# EasyEDA schematic SCH_PCB project A_2022-12-09.json
TITLE: Linefollower Elektrischschema A; REV: 1.0; Date: 2022-12-10; Sheet: 1/1; Drawn By: Robbe Vaillemans; Company: Hogent
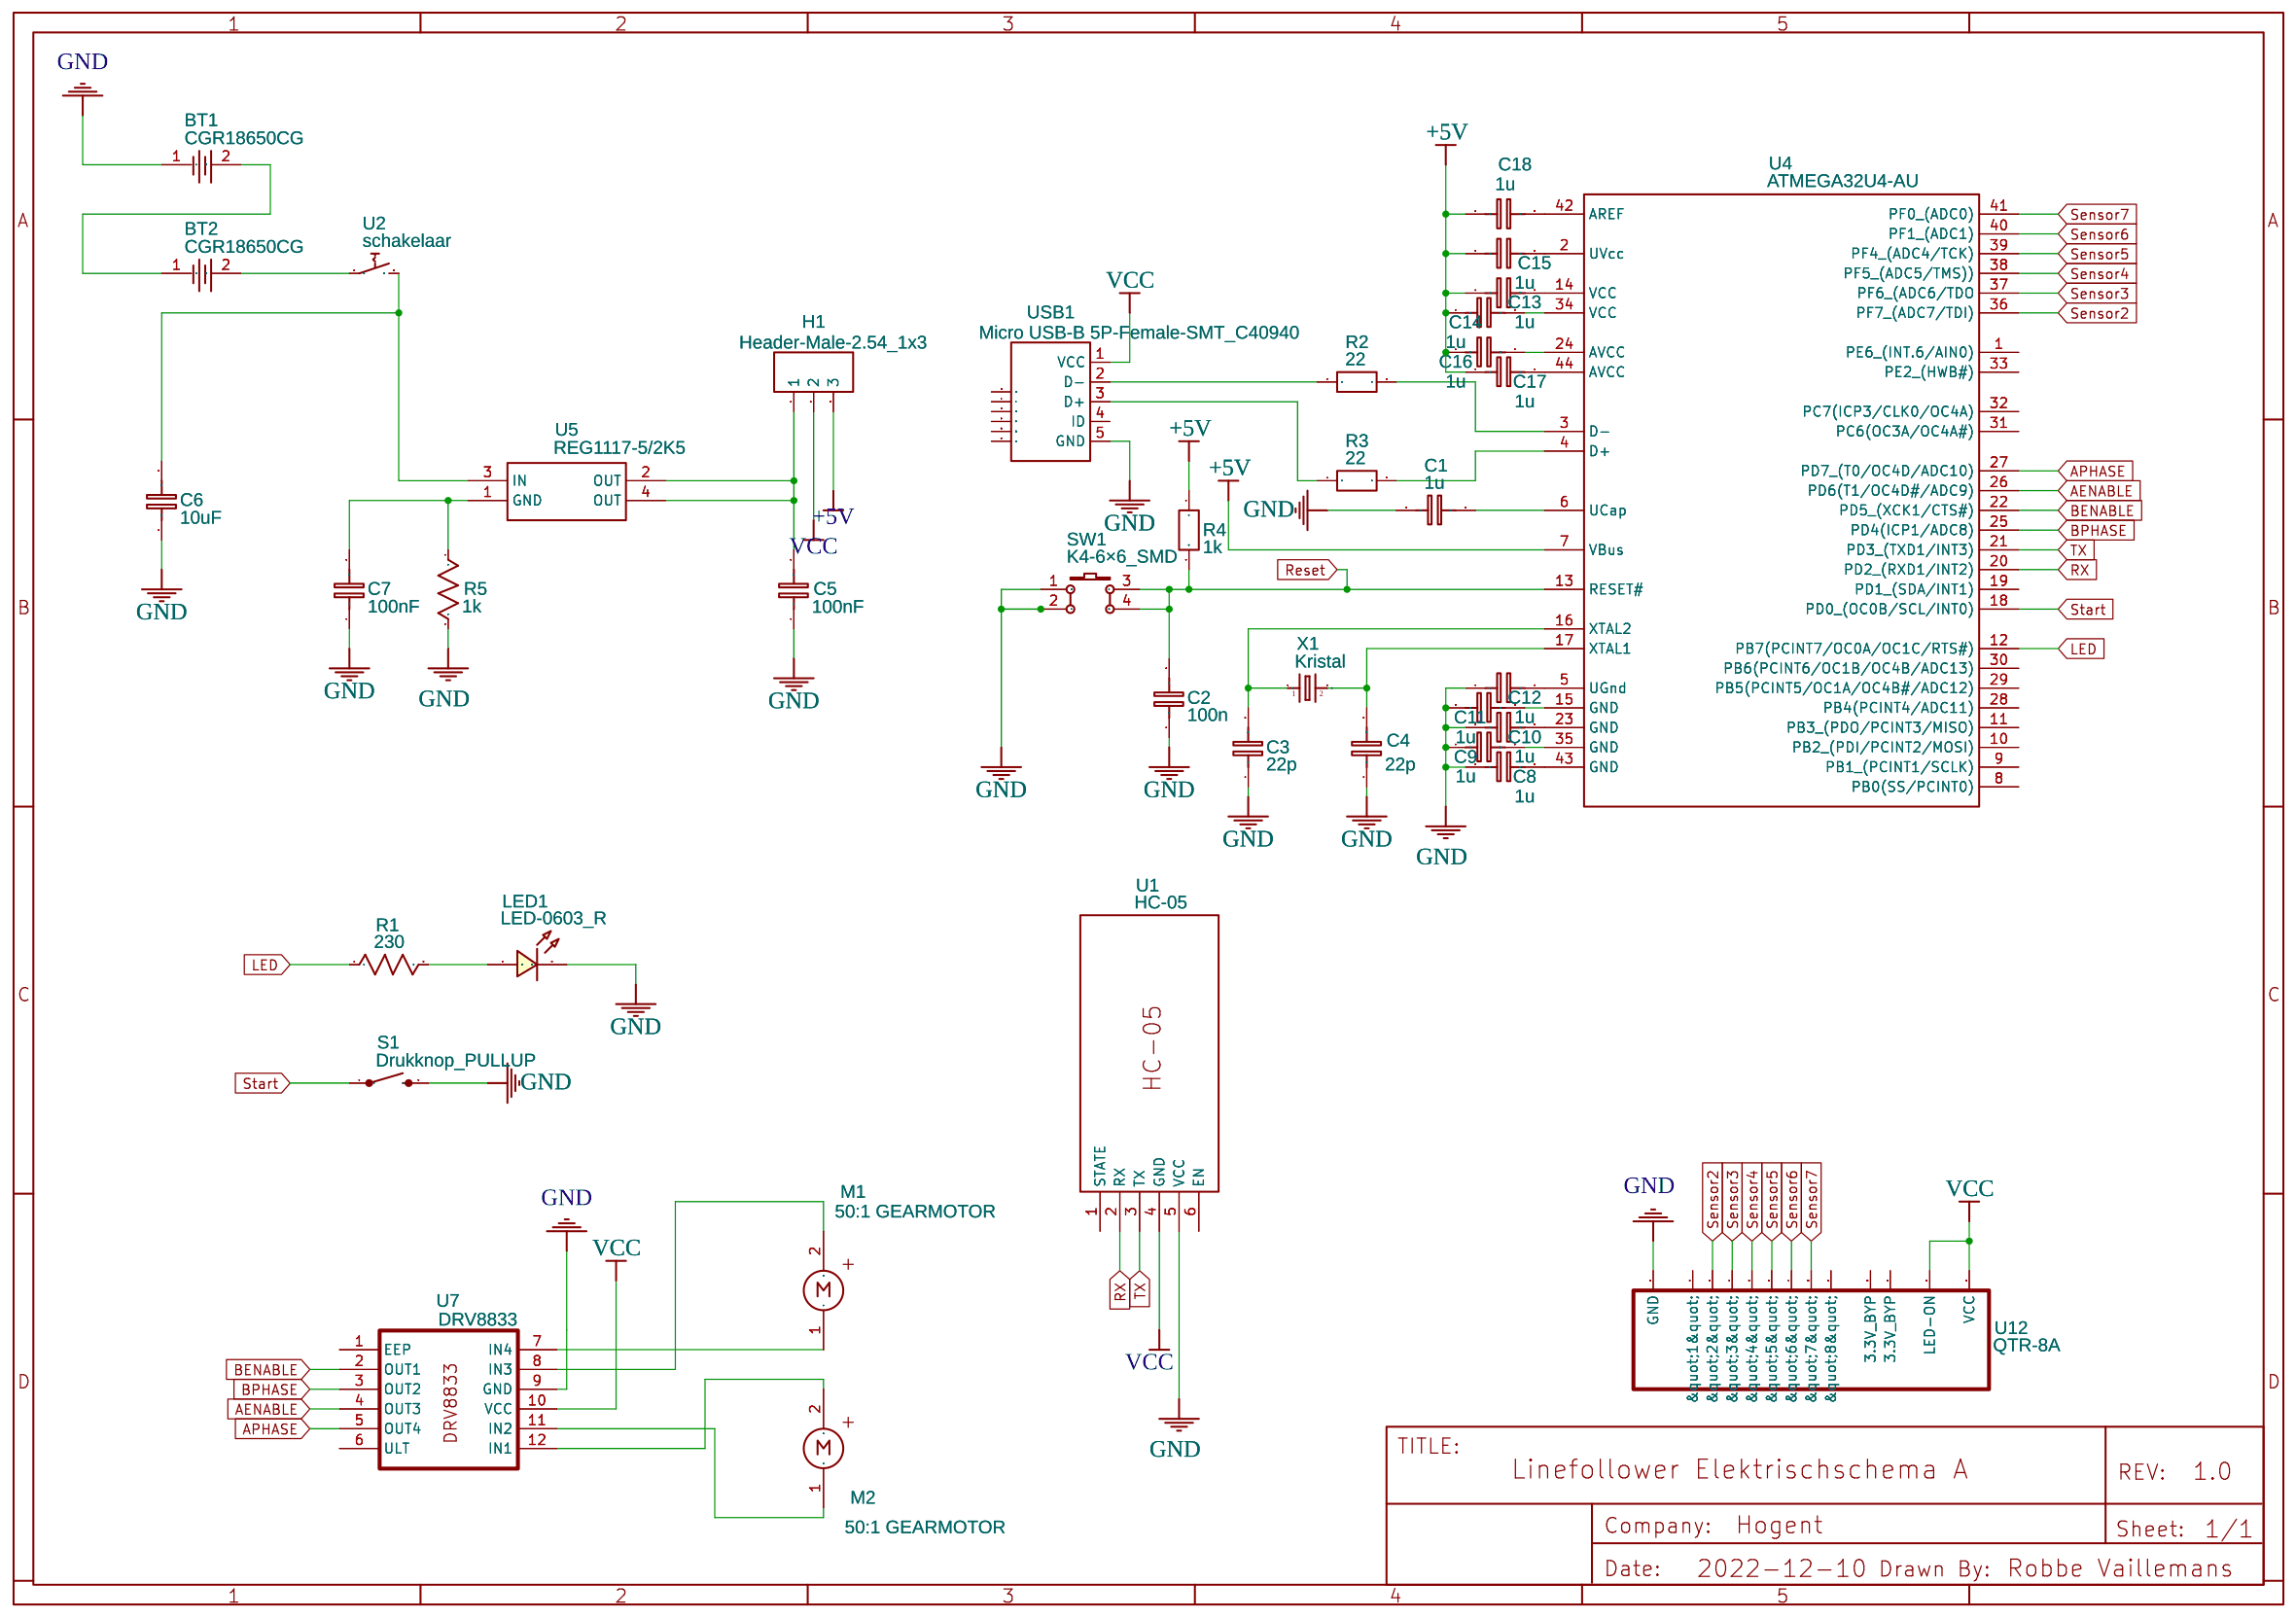
[diagram p0: schematic sheet]

## Parts
BT1  CGR18650CG  [BATTERY-SMD_18650-1S-L77.1-W20.7-1]
BT2  CGR18650CG  [BATTERY-SMD_18650-1S-L77.1-W20.7-1]
C1  1u  [C0603]
C2  100n  [C0603]
C3  22p  [C0603]
C4  22p  [C0603]
C5  100nF  [C0603]
C6  10uF  [C0603]
C7  100nF  [C0603]
C8  1u  [C0603]
C9  1u  [C0603]
C10  1u  [C0603]
C11  1u  [C0603]
C12  1u  [C0603]
C13  1u  [C0603]
C14  1u  [C0603]
C15  1u  [C0603]
C16  1u  [C0603]
C17  1u  [C0603]
C18  1u  [C0603]
H1  Header-Male-2.54_1x3  [HDR-TH_3P-P2.54-V-M-1]
LED1  LED-0603_R  [LED0603_RED]
M1  50:1 GEARMOTOR  [POLOLU-3071]
M2  50:1 GEARMOTOR  [POLOLU-3071]
R1  230  [R0603]
R2  22  [R0603]
R3  22  [R0603]
R4  1k  [R0603]
R5  1k  [R0603]
S1  Drukknop_PULLUP  [DRUKKNOP-PCB]
SW1  K4-6×6_SMD  [KEY-SMD_4P-L6.0-W6.0-P3.90-LS10.0]
U1  HC-05  [HM-10 LATEST]
U2  schakelaar
U4  ATMEGA32U4-AU  [QFP-44_L10.0-W10.0-P0.80-LS13.2-BL]
U5  REG1117-5/2K5  [SOT-223-4_L6.5-W3.5-P2.30-LS7.0-BR]
U7  DRV8833  [DRV8833 (NO ORIGINAL)]
U12  QTR-8A  [QTR-8A/8RC]
USB1  Micro USB-B 5P-Female-SMT_C40940  [MICRO-USB-SMD_5P-P0.65-H-M_MICRO-5P]
X1  Kristal  [KRISTAL]

## Library data of the parts
BT1 BT2 = BH-18650-B1BA002: Supplier: LCSC; Supplier Part: C2988620; Manufacturer: MYOUNG(美阳); link: https://atta.szlcsc.com/upload/public/pdf/source/20220402/870DB99AB50CA0DF8D51CF7C86A51FAB.pdf; Contributor: lcsc; JLCPCB Part Class: Extended Part
C1-C18 = C_0603_EU: Contributor: LCEDA_Lib
H1 = Header-Male-2.54_1x3: Supplier: LCSC; Manufacturer: BOOMELE; Manufacturer Part: Header2.54mm 1*3P; Supplier Part: C49257; JLCPCB Part Class: Extended Part
LED1 = LED-0603_R: Manufacturer: EVERLIGHT(台湾亿光); Manufacturer Part: 19-217/R6C-AL1M2VY/3T; Supplier Part: C72044; Supplier: LCSC; Contributor: LCEDA_01
M1 M2 = 10:1 MICRO METAL GEARMOTOR eskere: Manufacturer: Pololu; Manufacturer Part: 10:1 Micro Metal Gearmotor HPCB 6V with Extended Motor Shaft; Supplier: Pololu; Supplier Part: 3071; link: https://www.pololu.com/product/3071; Contributor: cheght
R1 R5 = R_0603_US: Contributor: LCEDA_Lib
R2-R4 = R_0603_EU: Contributor: LCEDA_Lib
S1 = Drukknop: Various NO switches- pushbuttons, reed, etc; Contributor: Dompie
SW1 = K4-6×6_SMD: Supplier Part: C191626; Supplier: LCSC; Manufacturer: 韩国韩荣; Manufacturer Part: K2-6639SP-D4SC-04; Contributor: LCEDA_Lib
U1 = HM-10: Contributor: jmprice50
U2 = schakelaar: Contributor: onschacline
U4 = ATMEGA32U4-AU: Supplier: LCSC; Manufacturer: MICROCHIP; Supplier Part: C44854; JLCPCB Part Class: Extended Part
U5 = REG1117-5/2K5: Supplier: LCSC; Manufacturer: TI; Contributor: LCSC; Supplier Part: C139393; JLCPCB Part Class: Extended Part
U7 = DRV8833 (NO ORIGINAL): Contributor: PiterSantaCruz
U12 = QTR-8A: Manufacturer: Pololu; Supplier: Pololu; Supplier Part: 960; link: https://www.pololu.com/docs/pdf/0J12/QTR-8x.pdf; Contributor: Junikos
USB1 = Micro USB-B 5P-Female-SMT_C40940: Supplier: LCSC; Manufacturer: ValuePro; Manufacturer Part: Micro USB-B 5P-Female-SMT; Contributor: LCSC; Supplier Part: C40940
X1 = Kristal: Contributor: Dompie

## Nets
+5V: C13.1 C14.1 C15.1 C16.1 C17.1 C18.1 H1.3 R4.1 U4.7(VBus)
GND: BT1.1 C1.1 C2.1 C3.1 C4.1 C5.1 C6.1 C7.1 C8.1 C9.1 C10.1 C11.1 C12.1 LED1.2 R5.2 S1.2 SW1.1(2) SW1.2(1) U1.5(VCC) U7.9(GND) U12.1(GND) USB1.5(GND)
VCC: H1.2 U1.4(GND) U7.10(VCC) U12.12(LED-ON) USB1.1(VCC)
AENABLE: U4.26(PD6(T1/OC4D#/ADC9)) U7.4(OUT3)
APHASE: U4.27(PD7 (T0/OC4D/ADC10)) U7.5(OUT4)
BENABLE: U4.22(PD5 (XCK1/CTS#)) U7.2(OUT1)
BPHASE: U4.25(PD4(ICP1/ADC8)) U7.3(OUT2)
LED: R1.1 U4.12(PB7(PCINT7/OC0A/OC1C/RTS#))
Reset: C2.2 R4.2 SW1.3(4) SW1.4(3) U4.13(RESET#)
RX: U1.2(RX) U4.20(PD2 (RXD1/INT2))
Sensor2: U4.36(PF7 (ADC7/TDI)) U12.3("2")
Sensor3: U4.37(PF6 (ADC6/TDO) U12.4("3")
Sensor4: U4.38(PF5 (ADC5/TMS))) U12.5("4")
Sensor5: U4.39(PF4 (ADC4/TCK)) U12.6("5")
Sensor6: U4.40(PF1 (ADC1)) U12.7("6")
Sensor7: U4.41(PF0 (ADC0)) U12.8("7")
Start: S1.1 U4.18(PD0 (OC0B/SCL/INT0))
TX: U1.3(TX) U4.21(PD3 (TXD1/INT3))
Net-(BT1-2): BT1.2 BT2.1
Net-(BT2-2): BT2.2 U2.2
Net-(C1-2): C1.2 U4.6(UCap)
Net-(C3-2): C3.2 U4.16(XTAL2) X1.1
Net-(C4-2): C4.2 U4.17(XTAL1) X1.2
Net-(C5-2): C5.2 H1.1 U5.2(OUT) U5.4(OUT)
Net-(C6-2): C6.2 U2.1 U5.3(IN)
Net-(C7-2): C7.2 R5.1 U5.1(GND)
Net-(C8-2): C8.2 U4.43(GND)
Net-(C9-2): C9.2 U4.35(GND)
Net-(C10-2): C10.2 U4.23(GND)
Net-(C11-2): C11.2 U4.15(GND)
Net-(C12-2): C12.2 U4.5(UGnd)
Net-(C13-2): C13.2 U4.14(VCC)
Net-(C14-2): C14.2 U4.34(VCC)
Net-(C15-2): C15.2 U4.2(UVcc)
Net-(C16-2): C16.2 U4.24(AVCC)
Net-(C17-2): C17.2 U4.44(AVCC)
Net-(C18-2): C18.2 U4.42(AREF)
Net-(LED1-1): LED1.1 R1.2
Net-(M1-1): M1.1 U7.7(IN4)
Net-(M1-2): M1.2 U7.8(IN3)
Net-(M2-1): M2.1 U7.11(IN2)
Net-(M2-2): M2.2 U7.12(IN1)
Net-(R2-1): R2.1 USB1.2(D-)
Net-(R2-2): R2.2 U4.3(D-)
Net-(R3-1): R3.1 USB1.3(D+)
Net-(R3-2): R3.2 U4.4(D+)

Not connected (* = marked no-connect by the designer): U1 1(STATE) 6(EN); U4 1(PE6 (INT.6/AIN0)) 8(PB0(SS/PCINT0)) 9(PB1 (PCINT1/SCLK)) 10(PB2 (PDI/PCINT2/MOSI)) 11(PB3 (PDO/PCINT3/MISO)) 19(PD1 (SDA/INT1)) 28(PB4(PCINT4/ADC11)) 29(PB5(PCINT5/OC1A/OC4B#/ADC12)) 30(PB6(PCINT6/OC1B/OC4B/ADC13)) 31(PC6(OC3A/OC4A#)) 32(PC7(ICP3/CLK0/OC4A)) 33(PE2 (HWB#)); U7 1(EEP) 6(ULT); U12 2("1") 9("8") 10(3.3V BYP) 11(3.3V BYP); USB1 4(ID) 6 7 8 9 10 11
